# EAGLE design Level Sensor v1 (EAGLE 6.5.0)
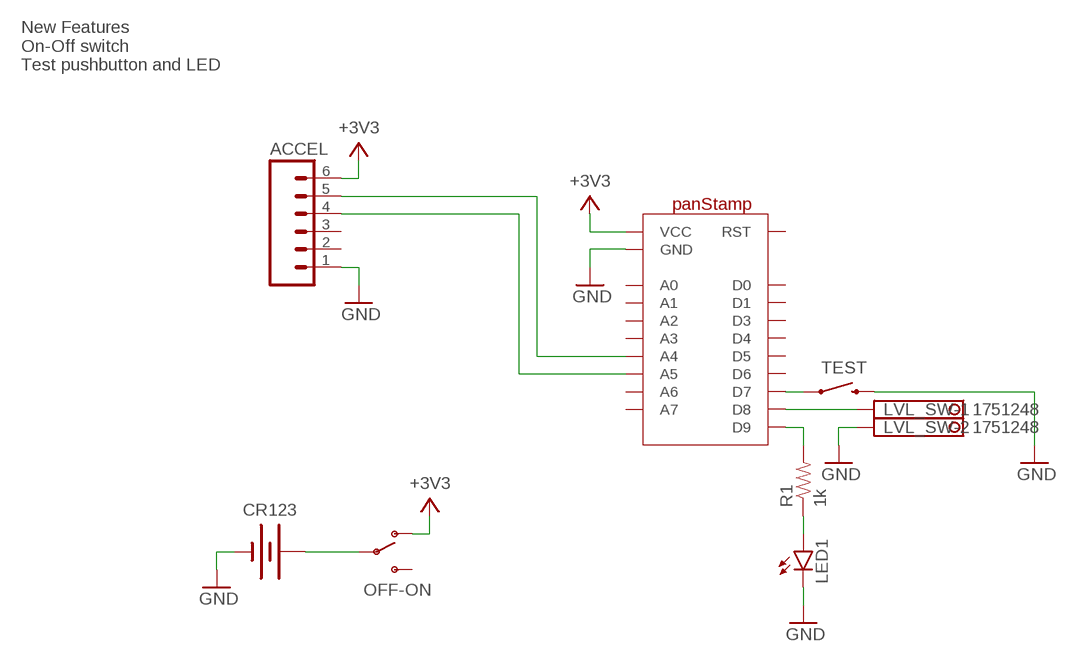
[diagram p0: schematic, sheet 1]

## Parts
ACCEL  M06LONGPADS  [1X06_LONGPADS]
CR123  BATTERY_CR123_SINGLE  [BATTERY_CR123]
LED1  LED3MM  [LED3MM]
LVL_SW  1751248  [1751248]
OFF-ON  SWITCH-SPDTPTH  [SWITCH-SPDT]
R1  1k  RESISTORPTH-1/4W  [AXIAL-0.4]
TEST  SWITCH-MOMENTARY-2PTH  [TACTILE-PTH]
U$1  PANSTAMPWITH_TEXT  [PANSTAMP]

## Nets
+3V3: ACCEL.6 OFF-ON.1(O) U$1.VCC
BAT+: CR123.POS(+) OFF-ON.2(P)
GND: ACCEL.1 CR123.NEG(-) LED1.K(C) LVL_SW.2 TEST.3 U$1.GND$1(GND) U$1.GND$7(GND) U$1.GND$15(GND) U$1.GND$23(GND) U$1.GND$24(GND)
N$1: LVL_SW.1 U$1.D8
N$2: TEST.1 U$1.D7
N$3: R1.P$2 U$1.D9
N$4: LED1.A R1.P$1
SCL: ACCEL.4 U$1.A5
SDA: ACCEL.5 U$1.A4
Unconnected: ACCEL.2 ACCEL.3 OFF-ON.3(S) U$1.A0 U$1.A1 U$1.A2 U$1.A3 U$1.A6 U$1.A7 U$1.D0 U$1.D1 U$1.D3 U$1.D4 U$1.D5 U$1.D6 U$1.RESET(RST)

## Notes on the sheet
- New Features
  On-Off switch
  Test pushbutton and LED

## Library data of the parts
ACCEL = SparkFun-Connectors:M06: Header 6 Standard 6-pin 0.1" header. Use with straight break away headers (SKU : PRT-00116), right angle break away headers (PRT-00553), swiss pins (PRT-00743), machine pins (PRT-00117), and female headers (PRT-00115). Molex polarized connector foot print use with SKU : PRT-08094 with associated crimp pins and housings. NOTES ON THE VARIANTS LOCK and LOCK_LONGPADS... This footprint was designed to help hold the alignment of a through-hole component (i.e. 6-pin header) while soldering it into place. You may notice that each hole has been shifted either up or down by 0.005 of an inch from it's more standard position (which is a perfectly straight line). This slight alteration caused the pins (the squares in the middle) to touch the edges of the holes. Because they are alternating, it causes a "brace" to hold the component in place. 0.005 has proven to be the perfect amount of "off-center" position when using our standard breakaway headers. Although looks a little odd when you look at the bare footprint, once you have a header in there, the alteration is very hard to notice. Also,if you push a header all the way into place, it is covered up entirely on the bottom side. This idea of altering the position of holes to aid alignment will be further integrated into the Sparkfun Library for other footprints. It can help hold any component with 3 or more connection pins.
CR123 = SRG:BATTERY_CR123
LED1 = SparkFun-LED:LED: LEDs Standard schematic elements and footprints for 5mm, 3mm, 1206, and 0603 sized LEDs. 5mm - Spark Fun Electronics SKU : COM-00529 (and others)
LVL_SW = con-phoenix-350:1751248: MKDS 1/ 2-3,5 Printklemme Nennstrom: 10 A Bemessungsspannung: 160 V Raster: 3,5 mm Polzahl: 2 Montageart: Löten Anschlussart: Schraubanschluss Anschlussrichtung vom Leiter zur Platine: 0° Source: http://eshop.phoenixcontact.com .. 1751248.pdf; OC_FARNELL: unknown; OC_NEWARK: unknown
OFF-ON = SparkFun-Electromechanical:SWITCH-SPDT: SPDT Switch Simple slide switch, Spark Fun Electronics SKU : COM-00102 DPDT SMT slide switch, AYZ0202, SWCH-08179
R1 = SparkFun-Resistors:RESISTOR: Resistor Basic schematic elements and footprints for 0603, 1206, and PTH resistors.
TEST = SparkFun-Electromechanical:SWITCH-MOMENTARY-2: Various NO switches- pushbuttons, reed, etc
U$1 = SRG:PANSTAMP: panStamp panStamps are small wireless modules programmable from the Arduino IDE. Each module contains an Atmega328p MCU and a Texas Instruments CC1101 RF interface, providing the necessary connectivity and processing power to create autonomous low-power wireless motes. Everything contained into a compact DIP-24 module. http://www.panstamp.com Vin: 2.5 to 3.6 volts A4 - SDA A5 - SCL PWM: D3,5,6,9,10,11 Interrupts: D2,3 Connected grounds with command: CONNECT ANY GND 'GND$1 GND$7 GND$15 GND$23 GND$24';

## Net classes
0 default: width 0.508 mm, drill 0.305 mm, clearance 0.254 mm

## Board
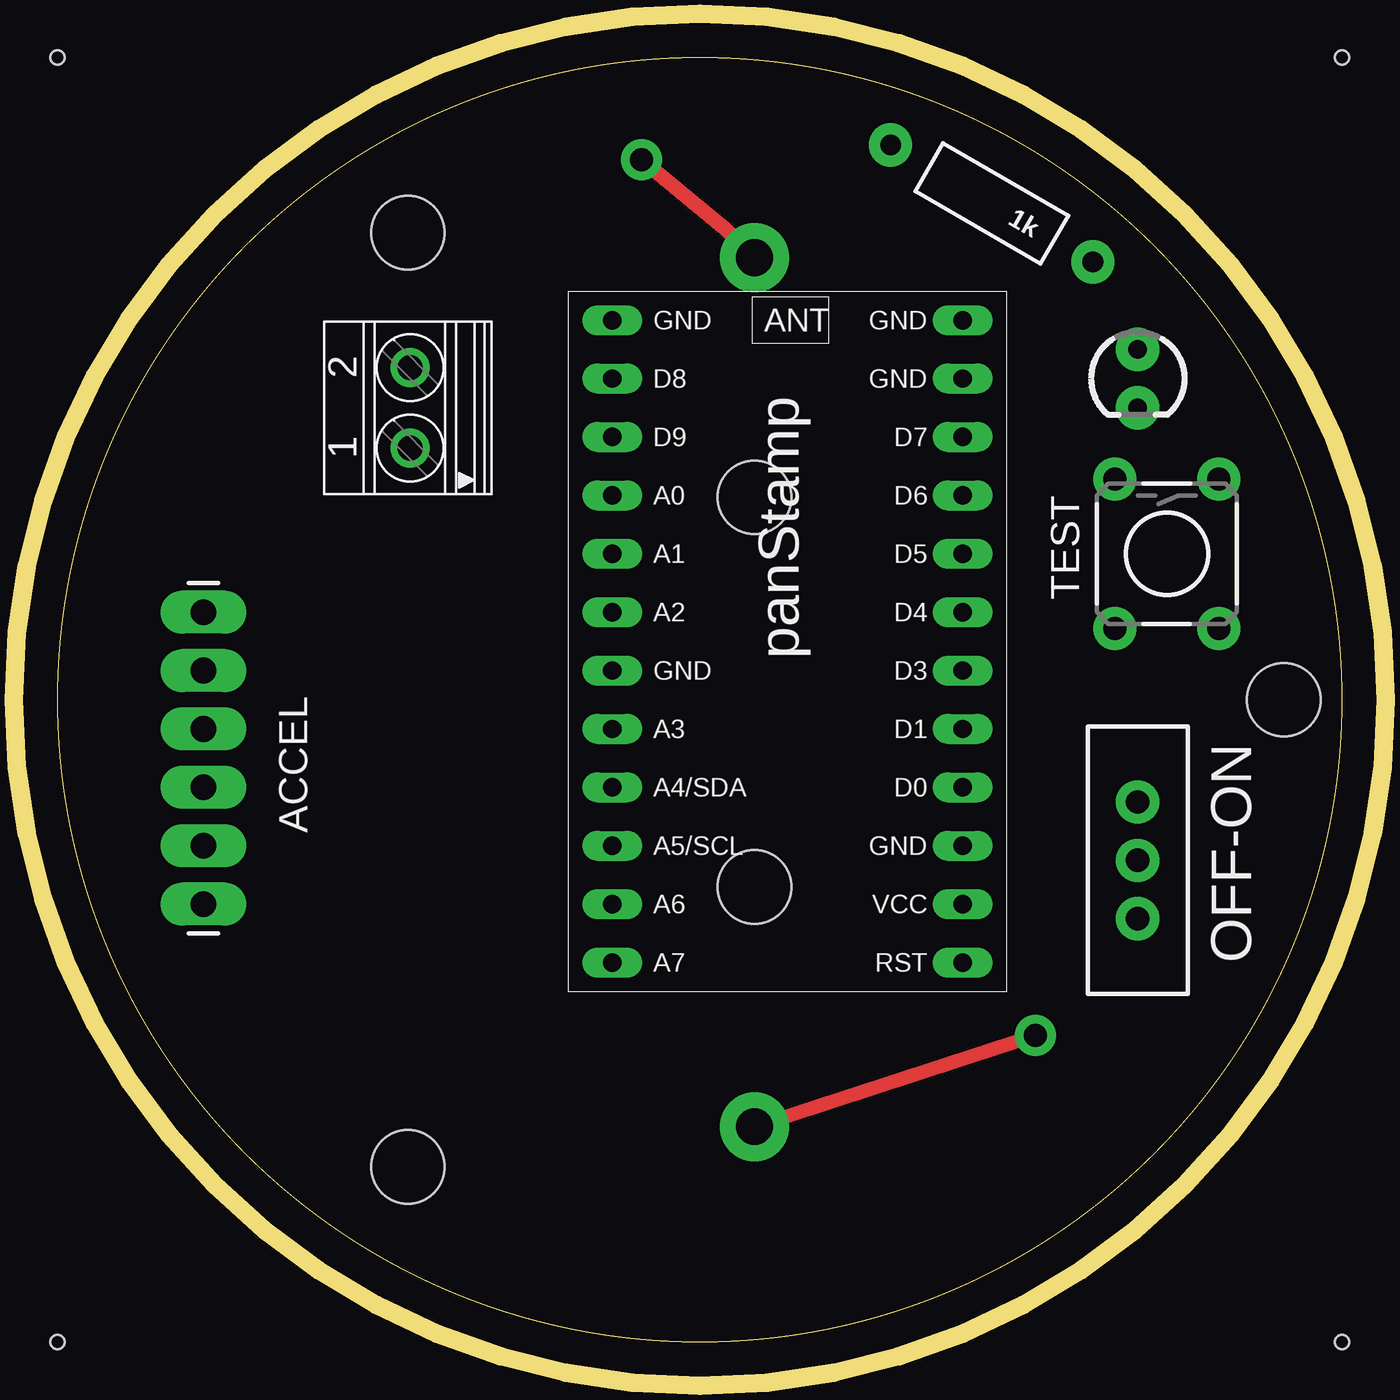
[diagram p1: board, top side]
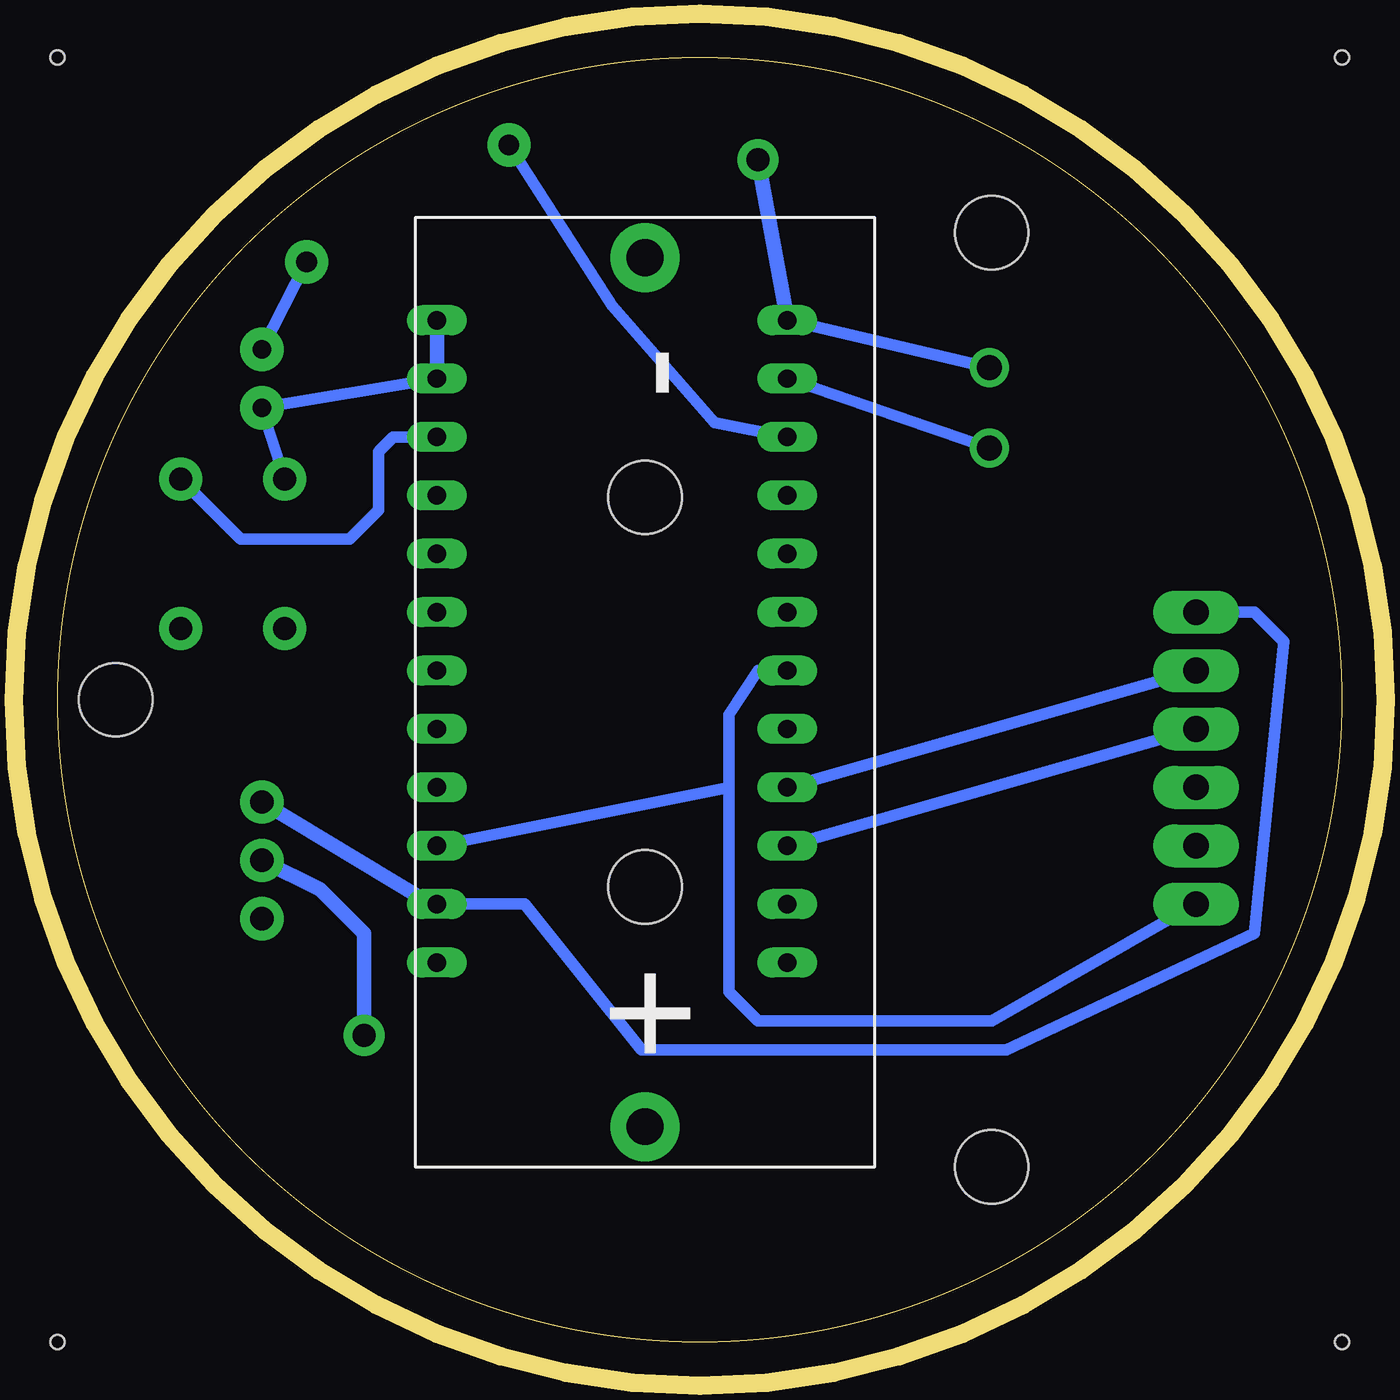
[diagram p2: board, bottom side, seen from below]

Size 55.88 x 55.88 mm. Coordinates in mm from the lower left corner, seen from the top.
Outline: circle at 27.94,27.94 radius 27.94
Copper layers (1*16): Top 0.035mm / dielectric 1.5mm / Bottom 0.035mm
Design rules "ShapeOko": minimum track width 12mil, minimum drill 24mil, track to track 25mil, track to pad 25mil, pad to pad 25mil, via to via 25mil, smd to smd 25mil, copper to edge 40mil, drill to drill 8mil, minimum pad ring 10mil, minimum via ring 8mil, stop-mask expansion 4mil, vias tented up to drill 0mil, thermal gap 10mil
Holes 3.2 mm at 15.24,48.26 15.24,7.62 53.34,27.94
Holes 0.6 mm at 0,0 55.88,0 55.88,55.88 0,55.88
Milling: 2 lines

### Footprints (pad centres in the part's own frame; a part is rotated, then mirrored left to right if it is on the bottom)
1X06_LONGPADS = drill 1.118 pad 1.88 long: 1 0,0; 2 2.54,0; 3 5.08,0; 4 7.62,0; 5 10.16,0; 6 12.7,0
BATTERY_CR123 = drill 1.6 pad 3: NEG 39.55,10; POS 1.75,10 | hole 3.2: 12.175,10; 29.125,10
LED3MM = drill 0.813 pad 1.88: A -1.27,0; K 1.27,0
1751248 = drill 1.1 pad 1.7: 1 -1.75,-0.1; 2 1.75,-0.1
SWITCH-SPDT = drill 1.016 pad 1.88: 1 0,2.54; 2 0,0; 3 0,-2.54
AXIAL-0.4 = drill 0.9 pad 1.88: P$1 -5.08,0; P$2 5.08,0
TACTILE-PTH = drill 1.016 pad 1.88: 1 -3.251,2.261; 2 3.251,2.261; 3 -3.251,-2.261; 4 3.251,-2.261
PANSTAMP = drill 0.8 long: A0 -7.62,7.62; A1 -7.62,5.08; A2 -7.62,2.54; A3 -7.62,-2.54; A4 -7.62,-5.08; A5 -7.62,-7.62; A6 -7.62,-10.16; A7 -7.62,-12.7; D0 7.62,-5.08; D1 7.62,-2.54; D3 7.62,0; D4 7.62,2.54; D5 7.62,5.08; D6 7.62,7.62; D7 7.62,10.16; D8 -7.62,12.7; D9 -7.62,10.16; GND$1 -7.62,15.24; GND$7 -7.62,0; GND$15 7.62,-7.62; GND$23 7.62,12.7; GND$24 7.62,15.24; RESET 7.62,-12.7; VCC 7.62,-10.16

### Placement (x,y rotation side)
ACCEL  6.35,19.05 90 top
CR123  20.32,7.62 90 bottom
LED1  46.99,41.91 270 top
LVL_SW  15.24,40.64 90 top
OFF-ON  46.99,20.95 0 top
R1  40.64,49.53 150 top
TEST  48.26,34.29 270 top
U$1  31.75,29.21 0 top

### Tracks (layer width: path | path; a pad name or v marks a point on that pad's centre or on a via)
+3V3
  Bottom 0.508: U$1.VCC 39.94,19.24 39.75,19.05 35.56,19.05 30.48,12.7 14.61,12.7 3.81,17.78 2.54,30.48 3.81,31.75 ACCEL.6
  Bottom 0.635: OFF-ON.1 39.94,19.24
BAT+  (via drill 1 pad 1.78)
  Top 0.635: CR123.POS v42.55,13.34
  Bottom 0.635: v42.55,13.34 42.55,17.78 44.45,19.68 OFF-ON.2
GND  (via drill 1 pad 1.78)
  Top 0.635: CR123.NEG 29.03,48.44 v25.4,51.44
  Bottom 0.508: LVL_SW.2 U$1.GND$1 | U$1.GND$7 25.4,29.21 26.67,27.3 26.67,24.13 | 26.67,24.13 26.67,15.24 25.4,13.97 15.24,13.97 ACCEL.1 | U$1.GND$23 LED1.K TEST.3 | U$1.GND$15 26.67,24.13
  Bottom 0.635: v25.4,51.44 U$1.GND$1 | U$1.GND$24 U$1.GND$23
N$1
  Bottom 0.508: LVL_SW.1 U$1.D8
N$2
  Bottom 0.508: U$1.D7 41.27,39.37 41.91,38.73 41.91,36.2 43.18,34.92 47.9,34.92 TEST.1
N$3
  Bottom 0.508: U$1.D9 27.3,40.01 31.75,45.09 R1.P$2
N$4
  Bottom 0.508: R1.P$1 LED1.A
SCL
  Bottom 0.508: ACCEL.4 U$1.A5
SDA
  Bottom 0.508: ACCEL.5 U$1.A4